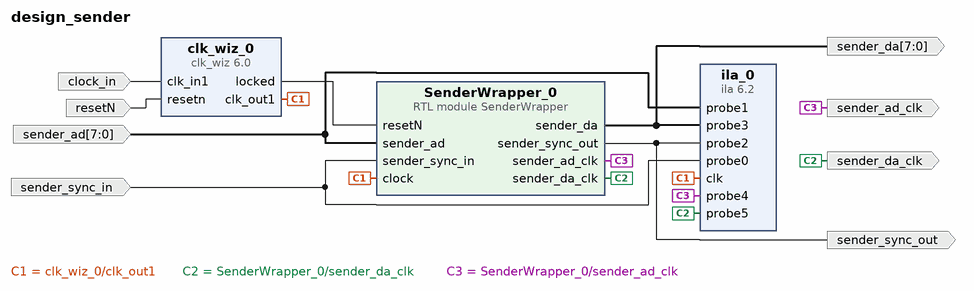
[diagram p0: block diagram of the top level]
# Vivado block design design_sender, xc7z020clg400-2, Vivado 2019.2_AR72614
create_bd_design design_sender

create_bd_port -dir I -type clk clock_in
set_property -dict {CONFIG.FREQ_HZ 50000000} [get_bd_ports clock_in]
create_bd_port -dir I -type rst resetN
create_bd_port -dir I -from 7 -to 0 -type data sender_ad
create_bd_port -dir I -type data sender_sync_in
create_bd_port -dir O -from 7 -to 0 -type data sender_da
create_bd_port -dir O -type data sender_sync_out
create_bd_port -dir O sender_ad_clk
create_bd_port -dir O sender_da_clk

create_bd_cell -type ip -vlnv xilinx.com:ip:clk_wiz:6.0 clk_wiz_0
set_property -dict [list \
  CONFIG.CLKIN1_JITTER_PS 200.0 \
  CONFIG.CLKOUT1_JITTER 156.886 \
  CONFIG.CLKOUT1_PHASE_ERROR 160.484 \
  CONFIG.CLKOUT1_REQUESTED_OUT_FREQ 120.000 \
  CONFIG.MMCM_CLKFBOUT_MULT_F 19.500 \
  CONFIG.MMCM_CLKIN1_PERIOD 20.000 \
  CONFIG.MMCM_CLKIN2_PERIOD 10.0 \
  CONFIG.MMCM_CLKOUT0_DIVIDE_F 8.125 \
  CONFIG.MMCM_DIVCLK_DIVIDE 1 \
  CONFIG.RESET_PORT resetn \
  CONFIG.RESET_TYPE ACTIVE_LOW \
] [get_bd_cells clk_wiz_0]
create_bd_cell -type module -reference SenderWrapper SenderWrapper_0
create_bd_cell -type ip -vlnv xilinx.com:ip:ila:6.2 ila_0
set_property -dict [list \
  CONFIG.C_DATA_DEPTH 8192 \
  CONFIG.C_ENABLE_ILA_AXI_MON false \
  CONFIG.C_MONITOR_TYPE Native \
  CONFIG.C_NUM_OF_PROBES 6 \
  CONFIG.C_PROBE1_WIDTH 8 \
  CONFIG.C_PROBE3_WIDTH 8 \
] [get_bd_cells ila_0]

# ---- connections ----

connect_bd_net [get_bd_pins clk_wiz_0/clk_out1] [get_bd_pins SenderWrapper_0/clock] [get_bd_pins ila_0/clk]
connect_bd_net [get_bd_ports clock_in] [get_bd_pins clk_wiz_0/clk_in1]
connect_bd_net [get_bd_ports resetN] [get_bd_pins clk_wiz_0/resetn]
connect_bd_net [get_bd_ports sender_ad] [get_bd_pins SenderWrapper_0/sender_ad] [get_bd_pins ila_0/probe1]
connect_bd_net [get_bd_pins clk_wiz_0/locked] [get_bd_pins SenderWrapper_0/resetN]
connect_bd_net [get_bd_ports sender_sync_in] [get_bd_pins SenderWrapper_0/sender_sync_in] [get_bd_pins ila_0/probe0]
connect_bd_net [get_bd_pins SenderWrapper_0/sender_da] [get_bd_ports sender_da] [get_bd_pins ila_0/probe3]
connect_bd_net [get_bd_pins SenderWrapper_0/sender_sync_out] [get_bd_ports sender_sync_out] [get_bd_pins ila_0/probe2]
connect_bd_net [get_bd_pins SenderWrapper_0/sender_da_clk] [get_bd_ports sender_da_clk] [get_bd_pins ila_0/probe5]
connect_bd_net [get_bd_pins SenderWrapper_0/sender_ad_clk] [get_bd_ports sender_ad_clk] [get_bd_pins ila_0/probe4]

validate_bd_design
save_bd_design
